# Altium schematic sheet 2014_carte_alim.SchDoc
size A4
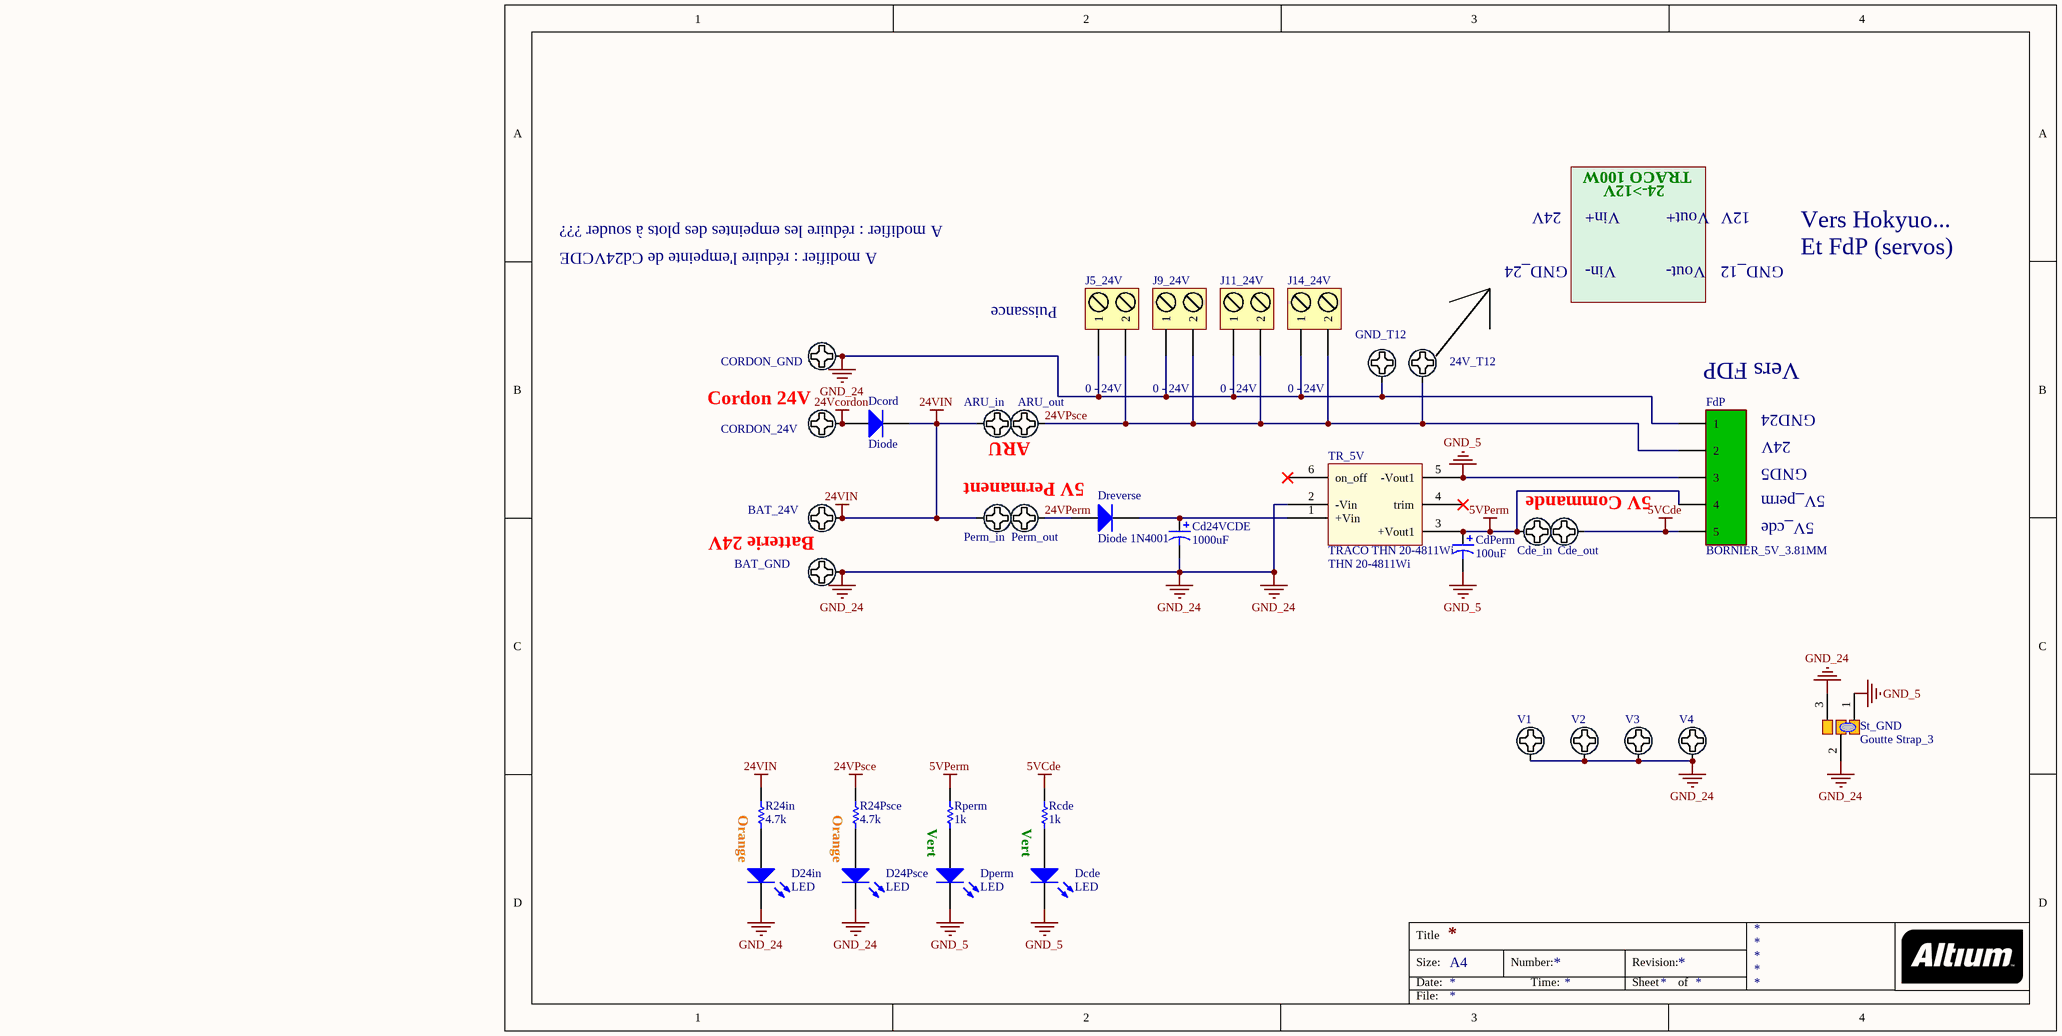
[diagram p0: 2014_carte_alim.SchDoc]

## Parts
24V_T12  Pad_M3  [M3x6mm]  (value not drawn)
ARU_in  Pad_M3  [M3x6mm]  (value not drawn)
ARU_out  Pad_M3  [M3x6mm]  (value not drawn)
BAT_24V  Pad_M3  [M3x6mm]  (value not drawn)
BAT_GND  Pad_M3  [M3x6mm]  (value not drawn)
Cd24VCDE  1000uF  [RESISTANCE_5W]
Cde_in  Pad_M3  [M3x6mm]  (value not drawn)
Cde_out  Pad_M3  [M3x6mm]  (value not drawn)
CdPerm  100uF  [CAPPR5-10X12.5_3D]
CORDON_24V  Pad_M3  [M3x6mm]  (value not drawn)
CORDON_GND  Pad_M3  [M3x6mm]  (value not drawn)
D24in  LED  [LED_0805]
D24Psce  LED  [LED_0805]
Dcde  LED  [LED_0805]
Dcord  Diode  [DIO10.46-5.3x2.8]
Dperm  LED  [LED_0805]
Dreverse  Diode 1N4001  [DIO10.46-5.3x2.8]
FdP  BORNIER_5V_3.81MM  [BORNIER_5V_3.81MM]
GND_T12  Pad_M3  [M3x6mm]  (value not drawn)
J5_24V  0 - 24V  [BORNIER2_FEM_COUDE]
J9_24V  0 - 24V  [BORNIER2_FEM_COUDE]
J11_24V  0 - 24V  [BORNIER2_FEM_COUDE]
J14_24V  0 - 24V  [BORNIER2_FEM_COUDE]
Perm_in  Pad_M3  [M3x6mm]  (value not drawn)
Perm_out  Pad_M3  [M3x6mm]  (value not drawn)
R24in  4.7k  [R1206_N]
R24Psce  4.7k  [R1206_N]
Rcde  1k  [R1206_N]
Rperm  1k  [R1206_N]
St_GND  Goutte Strap_3  [Goutte Strap_3]
TR_5V  TRACO THN 20-4811Wi  Ref: THN 20-4811Wi  [TRACO_THN20]
V1  Pad_M3  [M3x6mm]  (value not drawn)
V2  Pad_M3  [M3x6mm]  (value not drawn)
V3  Pad_M3  [M3x6mm]  (value not drawn)
V4  Pad_M3  [M3x6mm]  (value not drawn)

## Nets
5VCde: Cde_out.1 FdP.5 Rcde.1
5VPerm: Cde_in.1 CdPerm.1 FdP.4 Rperm.1 TR_5V.3(+Vout1)
24Vcordon: CORDON_24V.1 Dcord.1(A)
24VIN: ARU_in.1 BAT_24V.1 Dcord.2(K) Perm_in.1 R24in.1
24VPsce: 24V_T12.1 ARU_out.1 FdP.2 J5_24V.2 J9_24V.2 J11_24V.2 J14_24V.2 R24Psce.1
GND_5: CdPerm.2 Dcde.2(K) Dperm.2(K) FdP.3 St_GND.1 TR_5V.5(-Vout1)
GND_24: BAT_GND.1 Cd24VCDE.2 CORDON_GND.1 D24in.2(K) D24Psce.2(K) FdP.1 GND_T12.1 J5_24V.1 J9_24V.1 J11_24V.1 J14_24V.1 St_GND.2 St_GND.3 TR_5V.2(-Vin) V1.1 V2.1 V3.1 V4.1
24VPerm: Dreverse.1(A) Perm_out.1
NetCd24VCDE_1: Cd24VCDE.1 Dreverse.2(K) TR_5V.1(+Vin)
NetD24in_1: D24in.1(A) R24in.2
NetD24Psce_1: D24Psce.1(A) R24Psce.2
NetDcde_1: Dcde.1(A) Rcde.2
NetDperm_1: Dperm.1(A) Rperm.2

Not connected (* = marked no-connect by the designer): TR_5V 4(trim)* 6(on_off)*

## Notes on the sheet
- 24->12V
- TRACO 100W
- A modifier : réduire les empeintes des plots à souder ???
- A modifier : réduire l'empeinte de Cd24VCDE
- 24V
- Vin+
- Vout+
- 12V
- Vers Hokyuo...
- (near J5_24V) Puissance
- GND_24
- Vin-
- Vout-
- GND_12
- Et FdP (servos)
- (near FdP) Vers FDP
- Cordon 24V
- ARU
- GND24
- 5V Permanent
- 5V Commande
- 5V_perm
- 5V_cde
- GND5
- Batterie 24V
- Orange
- Vert
- Title
- Size:
- Date:
- A4
- Number:
- Time:
- Revision:
- Sheet
- of
- File:

## Library data of the parts
24V_T12 ARU_in ARU_out BAT_24V BAT_GND Cde_in Cde_out CORDON_24V CORDON_GND GND_T12 Perm_in Perm_out V1-V4 = Vis M3 X 6mm _TORX_Tête 6mm: Publisher: Damien Guitton
Cd24VCDE CdPerm = Condensateur Polarise Traversant: Polarized Capacitor
D24in D24Psce Dcde Dperm = LED: Typical LED; Published: 8-Jun-2000; LatestRevisionDate: 08-Jul-2005; LatestRevisionNote: Mech Layer 1 removed.; PackageReference: LED-1; Publisher: Altium Limited
Dcord Dreverse = Diode 1N4001: 1 Amp General Purpose Rectifier; Published: 8-Jun-2000; LatestRevisionDate: 17-Jul-2002; LatestRevisionNote: Re-released for DXP Platform.; DatasheetVersion: 1998; PackageVersion: Aug-1999; PackageReference: DO-41; Publisher: Altium Limited; Code_JEDEC: DO-204-AL; ComponentLink1Description: Manufacturer Link; ComponentLink1URL: http://www.fairchildsemi.com/; ComponentLink2Description: Datasheet; ComponentLink2URL: http://www.fairchildsemi.com/ds/1N%2F1N4001.pdf
J5_24V J9_24V J11_24V J14_24V = BORNIER2: Terminal blocks, 2 pins, pitch=5mm
R24in R24Psce Rcde Rperm = Resistor: Published: 8-Jun-2000; LatestRevisionDate: 17-Jul-2002; LatestRevisionNote: Re-released for DXP Platform.; PackageReference: AXIAL-0.5; Publisher: Altium Limited
TR_5V = TRACO THN 20-4811Wi: Traco 20W 24V to 5V*4A
St_GND = Goutte Strap_3: LatestRevisionDate: 25/11/09; Publisher: Damien Guitton